# EAGLE schematic main_schematic_3 (EAGLE 8.6.0)
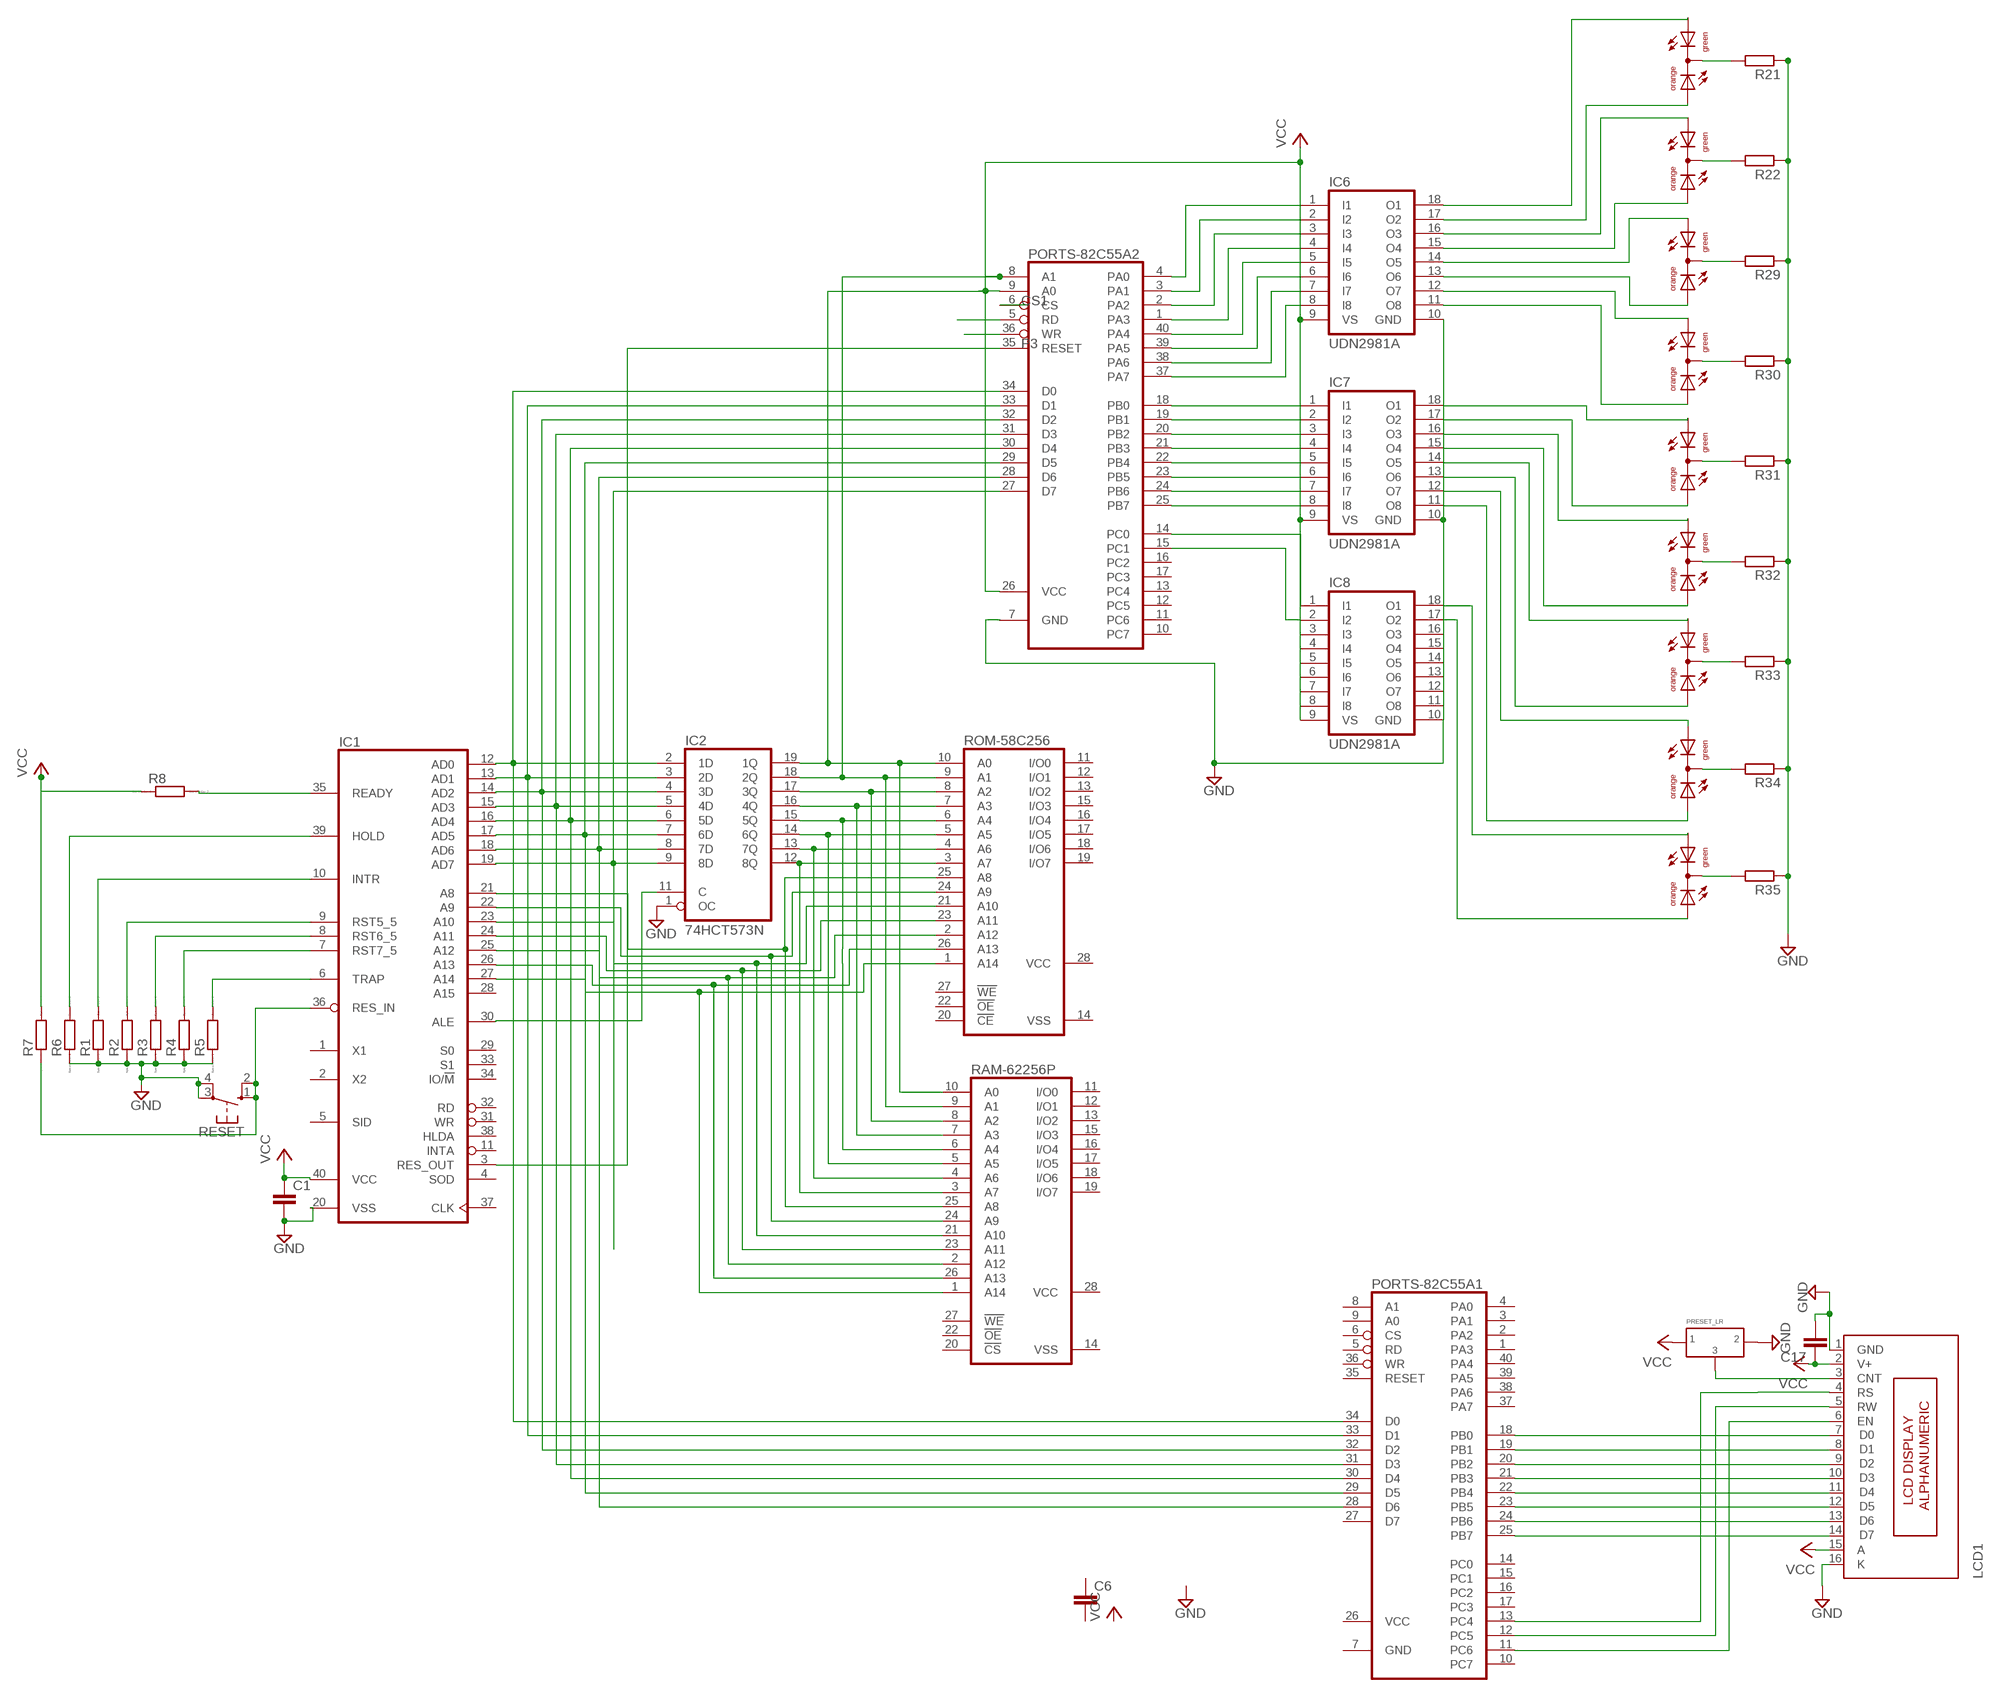
[diagram p0: schematic, sheet 1]

## Parts
C1  C2,5-3  [C2.5-3]
C6  C-EU050-024X044  [C050-024X044]
C17  C-EU025-024X044  [C025-024X044]
IC1  8085  [DIL40]
IC2  74HCT573N  [DIL20]
IC6  UDN2981A  [DIL18]
IC7  UDN2981A  [DIL18]
IC8  UDN2981A  [DIL18]
LCD1  16X2LCD  [16X2_LCD]
LED1  TLUV5300  [TLUV5300]
LED11  TLUV5300  [TLUV5300]
LED12  TLUV5300  [TLUV5300]
LED13  TLUV5300  [TLUV5300]
LED14  TLUV5300  [TLUV5300]
LED15  TLUV5300  [TLUV5300]
LED16  TLUV5300  [TLUV5300]
LED17  TLUV5300  [TLUV5300]
LED18  TLUV5300  [TLUV5300]
PORTS-82C55A1  82C55A  [DIL40]
PORTS-82C55A2  82C55A  [DIL40]
R1  R0204/7  [0204/7]
R2  R0204/7  [0204/7]
R3  R0204/7  [0204/7]
R4  R0204/7  [0204/7]
R5  R0204/7  [0204/7]
R6  R0204/7  [0204/7]
R7  R0204/7  [0204/7]
R8  R0204/7  [0204/7]
R21  R-EU_0204/7  [0204/7]
R22  R-EU_0204/7  [0204/7]
R29  R-EU_0204/7  [0204/7]
R30  R-EU_0204/7  [0204/7]
R31  R-EU_0204/7  [0204/7]
R32  R-EU_0204/7  [0204/7]
R33  R-EU_0204/7  [0204/7]
R34  R-EU_0204/7  [0204/7]
R35  R-EU_0204/7  [0204/7]
RAM-62256P  62256P  [DIL28-6]
RESET  10-XX  [B3F-10XX]
ROM-58C256  58C256P  [DIL28-6]
U$2  PRESET_LR  [PRESET_LR]

## Nets
A0: PORTS-82C55A2.9(A0)
A1: IC2.18(2Q) PORTS-82C55A2.8(A1) RAM-62256P.9(A1) ROM-58C256.9(A1)
CS1: PORTS-82C55A2.6(CS)
GND: C1.2 C17.2 IC1.20(VSS) IC6.10(GND) IC7.10(GND) IC8.10(GND) LCD1.1(GND) LCD1.16(K) PORTS-82C55A2.7(GND) R1.1 R2.1 R3.1 R4.1 R5.1 R6.1 R21.1 R22.1 R29.1 R30.1 R31.1 R32.1 R33.1 R34.1 R35.1 RESET.3(P) RESET.4(P1) U$2.P$2
N$1: IC1.39(HOLD) R6.2
N$2: IC1.10(INTR) R1.2
N$3: IC1.9(RST5_5) R2.2
N$4: IC1.8(RST6_5) R3.2
N$5: IC1.7(RST7_5) R4.2
N$6: IC1.6(TRAP) R5.2
N$7: IC1.36(RES_IN) R7.1 RESET.1(S) RESET.2(S1)
N$8: IC1.35(READY) R8.2
N$9: IC1.30(ALE) IC2.11(C)
N$10: IC6.1(I1) PORTS-82C55A2.4(PA0)
N$11: IC6.2(I2) PORTS-82C55A2.3(PA1)
N$12: IC7.1(I1) PORTS-82C55A2.18(PB0)
N$13: IC6.3(I3) PORTS-82C55A2.2(PA2)
N$14: IC6.4(I4) PORTS-82C55A2.1(PA3)
N$15: IC6.5(I5) PORTS-82C55A2.40(PA4)
N$16: IC6.6(I6) PORTS-82C55A2.39(PA5)
N$17: IC6.7(I7) PORTS-82C55A2.38(PA6)
N$18: LCD1.4(RS) PORTS-82C55A1.13(PC4)
N$19: LCD1.5(RW) PORTS-82C55A1.12(PC5)
N$20: LCD1.6(EN) PORTS-82C55A1.11(PC6)
N$75: LCD1.14(D7) PORTS-82C55A1.25(PB7)
N$76: LCD1.13(D6) PORTS-82C55A1.24(PB6)
N$88: LCD1.12(D5) PORTS-82C55A1.23(PB5)
N$90: IC2.17(3Q) RAM-62256P.8(A2) ROM-58C256.8(A2)
N$91: IC2.16(4Q) RAM-62256P.7(A3) ROM-58C256.7(A3)
N$92: LCD1.11(D4) PORTS-82C55A1.22(PB4)
N$93: LCD1.10(D3) PORTS-82C55A1.21(PB3)
N$95: LCD1.9(D2) PORTS-82C55A1.20(PB2)
N$96: LCD1.8(D1) PORTS-82C55A1.19(PB1)
N$97: LCD1.7(D0) PORTS-82C55A1.18(PB0)
N$98: LCD1.3(CNT) U$2.P$3
N$99: IC2.15(5Q) RAM-62256P.6(A4) ROM-58C256.6(A4)
N$100: IC2.14(6Q) RAM-62256P.5(A5) ROM-58C256.5(A5)
N$101: IC2.13(7Q) RAM-62256P.4(A6) ROM-58C256.4(A6)
N$102: IC2.12(8Q) RAM-62256P.3(A7) ROM-58C256.3(A7)
N$103: IC1.21(A8) RAM-62256P.25(A8) ROM-58C256.25(A8)
N$104: IC1.22(A9) RAM-62256P.24(A9) ROM-58C256.24(A9)
N$105: IC1.23(A10) RAM-62256P.21(A10) ROM-58C256.21(A10)
N$106: IC1.24(A11) RAM-62256P.23(A11) ROM-58C256.23(A11)
N$107: IC1.25(A12) RAM-62256P.2(A12) ROM-58C256.2(A12)
N$108: IC1.26(A13) RAM-62256P.26(A13) ROM-58C256.26(A13)
N$113: IC1.27(A14) RAM-62256P.1(A14) ROM-58C256.1(A14)
N$118: PORTS-82C55A2.36(WR)
N$119: IC6.8(I8) PORTS-82C55A2.37(PA7)
N$120: IC7.2(I2) PORTS-82C55A2.19(PB1)
N$121: IC7.3(I3) PORTS-82C55A2.20(PB2)
N$122: IC7.4(I4) PORTS-82C55A2.21(PB3)
N$123: IC7.5(I5) PORTS-82C55A2.22(PB4)
N$124: IC7.6(I6) PORTS-82C55A2.23(PB5)
N$125: IC7.7(I7) PORTS-82C55A2.24(PB6)
N$126: IC7.8(I8) PORTS-82C55A2.25(PB7)
N$127: IC8.1(I1) PORTS-82C55A2.14(PC0)
N$128: IC8.2(I2) PORTS-82C55A2.15(PC1)
N$135: IC6.18(O1) LED1.AG
N$136: IC6.17(O2) LED1.AO
N$137: IC6.16(O3) LED11.AG
N$138: IC6.15(O4) LED11.AO
N$139: IC6.14(O5) LED12.AG
N$140: IC6.13(O6) LED12.AO
N$141: IC6.12(O7) LED13.AG
N$142: IC6.11(O8) LED13.AO
N$143: IC7.18(O1) LED14.AG
N$144: IC7.17(O2) LED14.AO
N$145: IC7.16(O3) LED15.AG
N$146: IC7.15(O4) LED15.AO
N$147: IC7.14(O5) LED16.AG
N$148: IC7.13(O6) LED16.AO
N$149: IC7.12(O7) LED17.AG
N$150: IC7.11(O8) LED17.AO
N$151: IC8.18(O1) LED18.AG
N$152: IC8.17(O2) LED18.AO
N$155: LED18.CC R35.2
N$156: LED17.CC R34.2
N$157: LED16.CC R33.2
N$158: LED15.CC R32.2
N$159: LED13.CC R30.2
N$160: LED12.CC R29.2
N$161: LED11.CC R22.2
N$162: LED1.CC R21.2
N$163: LED14.CC R31.2
NETSEG1: PORTS-82C55A2.5(RD)
P1: IC1.12(AD0) IC2.2(1D) PORTS-82C55A1.34(D0) PORTS-82C55A2.34(D0)
P2: IC1.13(AD1) IC2.3(2D) PORTS-82C55A1.33(D1) PORTS-82C55A2.33(D1)
P3: IC1.3(RES_OUT) PORTS-82C55A2.35(RESET)
P4: IC1.14(AD2) IC2.4(3D) PORTS-82C55A1.32(D2) PORTS-82C55A2.32(D2)
P5: IC1.15(AD3) IC2.5(4D) PORTS-82C55A1.31(D3) PORTS-82C55A2.31(D3)
P6: IC1.17(AD5) IC2.7(6D) PORTS-82C55A1.29(D5) PORTS-82C55A2.29(D5)
P7: IC1.19(AD7) IC2.9(8D) PORTS-82C55A2.27(D7)
P8: IC1.18(AD6) IC2.8(7D) PORTS-82C55A1.28(D6) PORTS-82C55A2.28(D6)
P9: IC1.16(AD4) IC2.6(5D) PORTS-82C55A1.30(D4) PORTS-82C55A2.30(D4)
VCC: C1.1 C17.1 IC1.40(VCC) IC2.19(1Q) IC6.9(VS) IC7.9(VS) IC8.9(VS) LCD1.2(V+) LCD1.15(A) PORTS-82C55A2.26(VCC) R7.2 R8.1 RAM-62256P.10(A0) ROM-58C256.10(A0) U$2.P$1
Unconnected: C6.1 C6.2 IC1.1(X1) IC1.2(X2) IC1.4(SOD) IC1.5(SID) IC1.11(INTA) IC1.28(A15) IC1.29(S0) IC1.31(WR) IC1.32(RD) IC1.33(S1) IC1.34(IO/!M) IC1.37(CLK) IC1.38(HLDA) IC2.1(OC) IC8.3(I3) IC8.4(I4) IC8.5(I5) IC8.6(I6) IC8.7(I7) IC8.8(I8) IC8.11(O8) IC8.12(O7) IC8.13(O6) IC8.14(O5) IC8.15(O4) IC8.16(O3) PORTS-82C55A1.1(PA3) PORTS-82C55A1.2(PA2) PORTS-82C55A1.3(PA1) PORTS-82C55A1.4(PA0) PORTS-82C55A1.5(RD) PORTS-82C55A1.6(CS) PORTS-82C55A1.8(A1) PORTS-82C55A1.9(A0) PORTS-82C55A1.10(PC7) PORTS-82C55A1.14(PC0) PORTS-82C55A1.15(PC1) PORTS-82C55A1.16(PC2) PORTS-82C55A1.17(PC3) PORTS-82C55A1.27(D7) PORTS-82C55A1.35(RESET) PORTS-82C55A1.36(WR) PORTS-82C55A1.37(PA7) PORTS-82C55A1.38(PA6) PORTS-82C55A1.39(PA5) PORTS-82C55A1.40(PA4) PORTS-82C55A2.10(PC7) PORTS-82C55A2.11(PC6) PORTS-82C55A2.12(PC5) PORTS-82C55A2.13(PC4) PORTS-82C55A2.16(PC2) PORTS-82C55A2.17(PC3) RAM-62256P.11(I/O0) RAM-62256P.12(I/O1) RAM-62256P.13(I/O2) RAM-62256P.15(I/O3) RAM-62256P.16(I/O4) RAM-62256P.17(I/O5) RAM-62256P.18(I/O6) RAM-62256P.19(I/O7) RAM-62256P.20(!CS) RAM-62256P.22(!OE) RAM-62256P.27(!WE) ROM-58C256.11(I/O0) ROM-58C256.12(I/O1) ROM-58C256.13(I/O2) ROM-58C256.15(I/O3) ROM-58C256.16(I/O4) ROM-58C256.17(I/O5) ROM-58C256.18(I/O6) ROM-58C256.19(I/O7) ROM-58C256.20(!CE) ROM-58C256.22(!OE) ROM-58C256.27(!WE)

## Power pins joined to a net without a drawn wire
GND: IC2.10(GND) PORTS-82C55A1.7(GND)
VCC: IC2.20(VCC) PORTS-82C55A1.26(VCC) RAM-62256P.28(VCC) ROM-58C256.28(VCC)
VSS: RAM-62256P.14(VSS) ROM-58C256.14(VSS)

## Library data of the parts
C1 = capacitor-wima:C: CAPACITOR naming: grid - package width
C6 = resistor:C-EU: CAPACITOR, European symbol
C17 = rcl:C-EU: CAPACITOR, European symbol
IC1 = micro-intel:8085: MICROCOMPUTER/PERIPHERAL DEVICE; OC_FARNELL: unknown; OC_NEWARK: unknown
IC2 = 74xx-eu:74*573: 8-bit D latch BUS DRIVER
IC6-IC8 = uln-udn:UDN298*: DRIVER ARRAY Source: Allegro Microsystems Inc. / UDN2981-UDN2984.pdf
LCD1 = CEDT_JANUARY_2015_v5:16X2LCD: ALPHANUMERIC-LCD
LED1 LED11-LED18 = led:TLUV5300: Bicolor LED 5 mm Untinted Diffused Package Source: www.vishay.com .. Bi-Color LED Vashay TLUV5300.pdf
PORTS-82C55A1 PORTS-82C55A2 = micro-intel:82C55A: MICROCOMPUTER/PERIPHERAL DEVICE; MF: INTERSIL; MPN: IP82C55AZ; OC_FARNELL: 1562050; OC_NEWARK: 79K6939
R1-R8 = eagle-ltspice:R: RESISTOR, European symbol; SPICEMODEL: NONE; SPICEPREFIX: R
R21 R22 R29-R35 = resistor:R-EU_: RESISTOR, European symbol
RAM-62256P = memory-hitachi:62256P: MEMORY; OC_FARNELL: unknown; OC_NEWARK: unknown
RESET = CEDT:10-XX: OMRON SWITCH
ROM-58C256 = memory-hitachi:58C256P: MEMORY; MPN: HN58C256AP85E; OC_FARNELL: 1496447; OC_NEWARK: 61M6616
U$2 = CEDT_JANUARY_2015_v5:PRESET_LR

## Net classes
0 default: width 0.406 mm
1 power: width 0.61 mm
2 GND: width 0.61 mm